# EAGLE schematic Telemetry_mainlayoutVer2 (EAGLE 8.2.1)
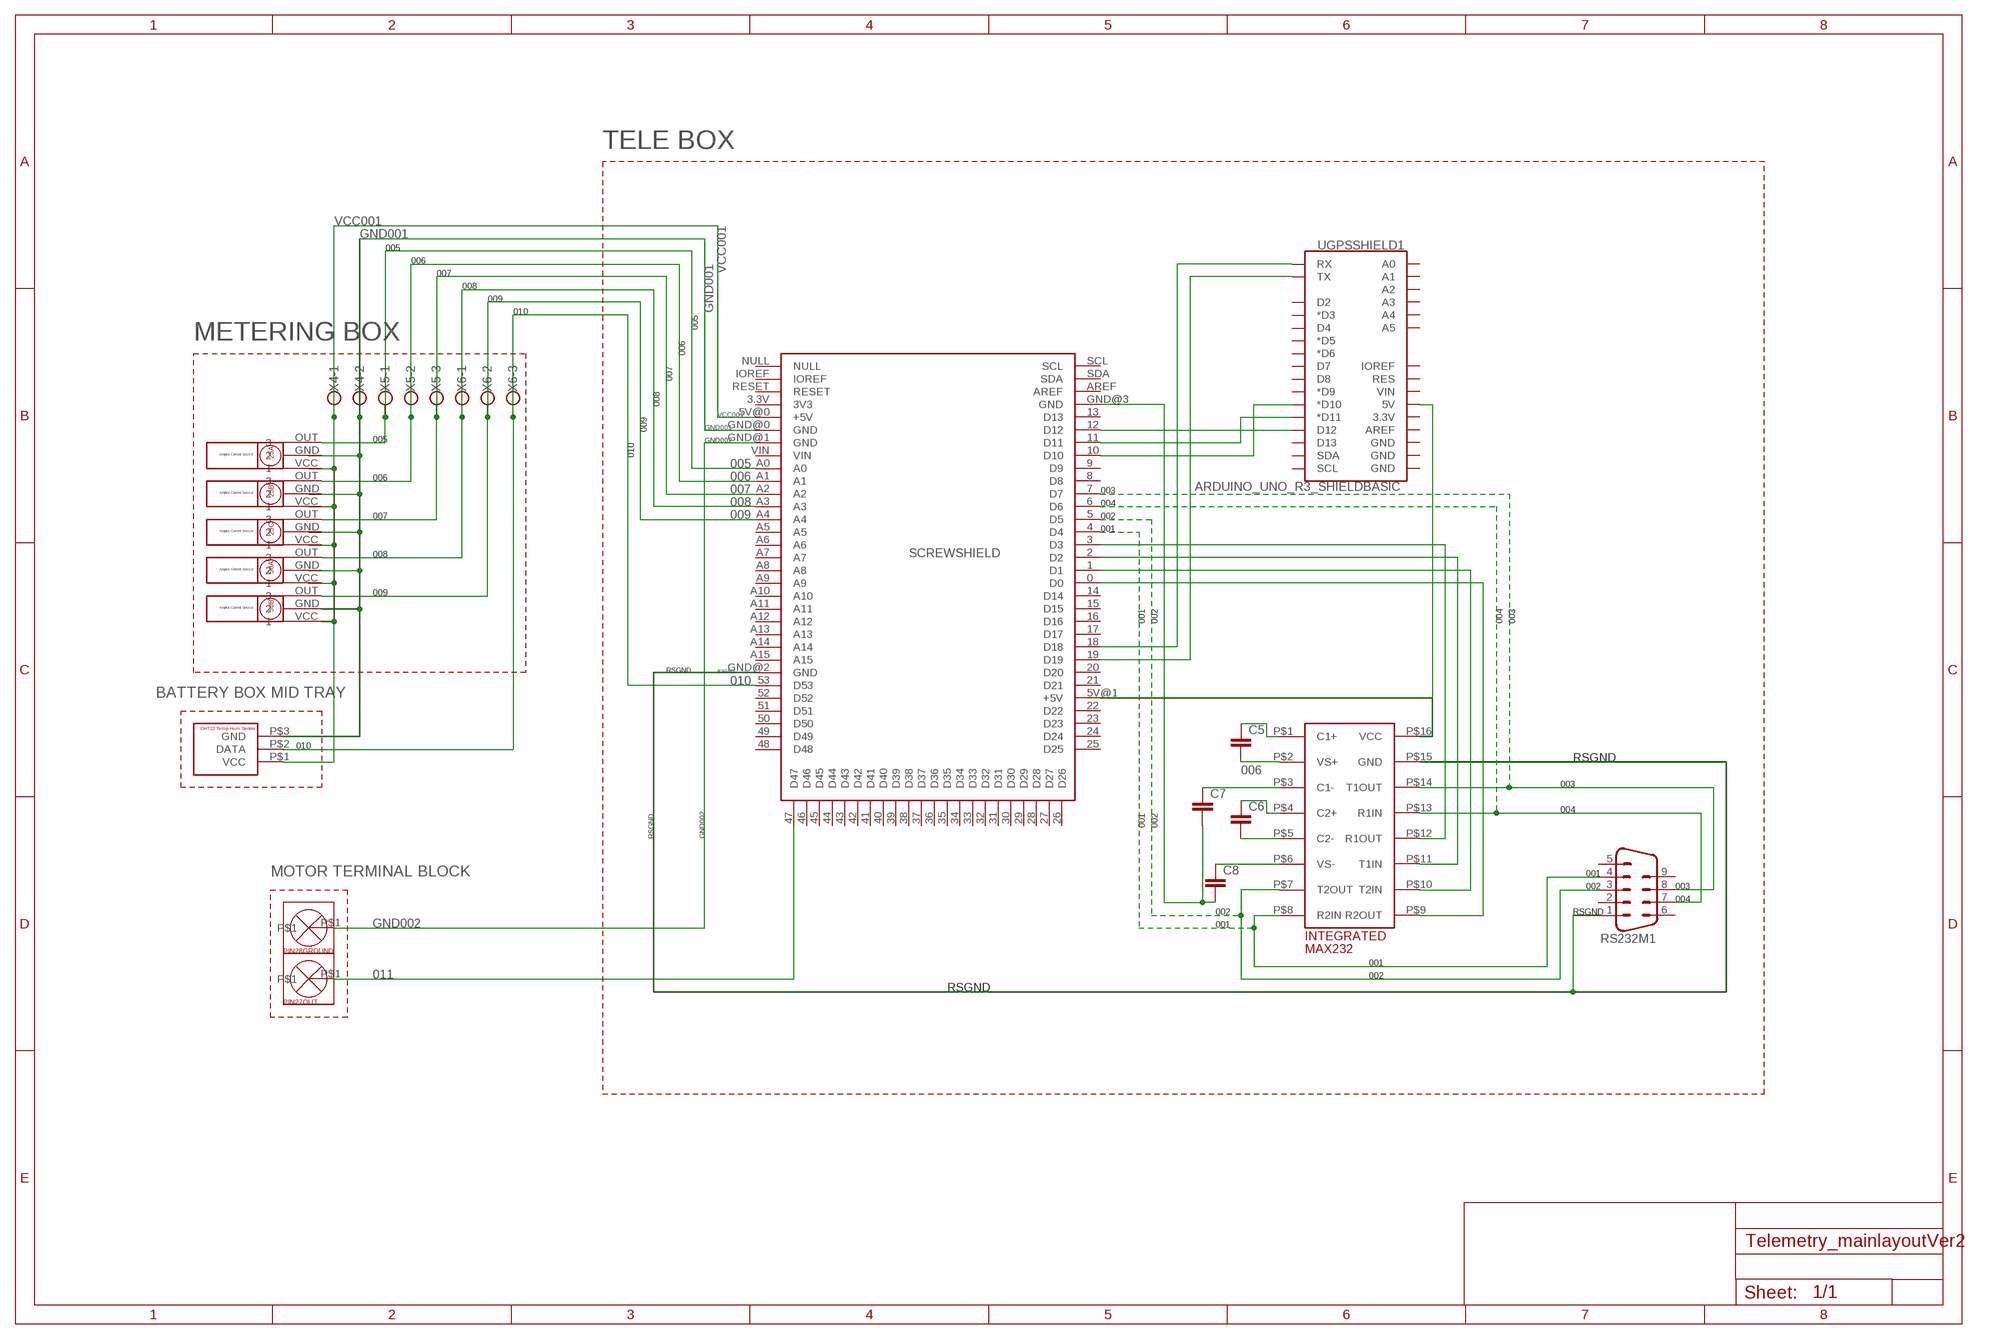
[diagram p0: schematic, sheet 1]

## Parts
25A  AMPLOC-CS  [AMPLOC]
25B  AMPLOC-CS  [AMPLOC]
25C  AMPLOC-CS  [AMPLOC]
50A  AMPLOC-CS  [AMPLOC]
50B  AMPLOC-CS  [AMPLOC]
C5  C2,5-3  [C2.5-3]
C6  C2,5-3  [C2.5-3]
C7  C2,5-3  [C2.5-3]
C8  C2,5-3  [C2.5-3]
INTEGRATED  MAX232TELE  [DIP16]
PIN27OUT  SCREWTERMINAL  [SCREWTERMINAL]
PIN28GROUND  SCREWTERMINAL  [SCREWTERMINAL]
RS232M1  M09HP  [M09HP]
SCREWSHIELD  PSCREWBPROTOSCREWSHIELD  [ARDUINO_MEGA]
U$8  DHT22  [DHT22]
UGPSSHIELD1  ARDUINO_UNO_R3_SHIELDBASIC  [UNO_R3_SHIELD]
X4  W237-102  [W237-102]
X5  W237-103  [W237-103]
X6  W237-103  [W237-103]

## Nets
N$1: INTEGRATED.P$8(R2IN) RS232M1.4 SCREWSHIELD.4(D4)
N$2: PIN28GROUND.P$1 SCREWSHIELD.GND@1(GND)
N$3: PIN27OUT.P$1 SCREWSHIELD.47(D47)
N$19: C5.1 INTEGRATED.P$1(C1+)
N$24: C5.2 INTEGRATED.P$2(VS+)
N$33: C6.2 INTEGRATED.P$5(C2-)
N$35: C6.1 INTEGRATED.P$4(C2+)
N$36: C8.1 INTEGRATED.P$6(VS-)
N$37: C7.2 C8.2 SCREWSHIELD.GND@3(GND)
N$38: INTEGRATED.P$16(VCC) SCREWSHIELD.5V@1(+5V) UGPSSHIELD1.5V
N$40: SCREWSHIELD.18(D18) UGPSSHIELD1.RX
N$41: SCREWSHIELD.19(D19) UGPSSHIELD1.TX
N$42: SCREWSHIELD.10(D10) UGPSSHIELD1.D10(*D10)
N$43: SCREWSHIELD.11(D11) UGPSSHIELD1.D11(*D11)
N$44: SCREWSHIELD.12(D12) UGPSSHIELD1.D12
N$45: 50B.OUT SCREWSHIELD.A4 X6.2
N$46: INTEGRATED.P$7(T2OUT) RS232M1.3 SCREWSHIELD.5(D5)
N$47: 25A.VCC 25B.VCC 25C.VCC 50A.VCC 50B.VCC SCREWSHIELD.5V@0(+5V) U$8.P$1(VCC) X4.1
N$48: INTEGRATED.P$15(GND) RS232M1.1 SCREWSHIELD.GND@2(GND)
N$49: INTEGRATED.P$13(R1IN) RS232M1.7 SCREWSHIELD.6(D6)
N$50: C7.1 INTEGRATED.P$3(C1-)
N$51: INTEGRATED.P$14(T1OUT) RS232M1.8 SCREWSHIELD.7(D7)
N$52: 50A.OUT SCREWSHIELD.A3 X6.1
N$53: 25A.OUT SCREWSHIELD.A0 X5.1
N$54: 25C.OUT SCREWSHIELD.A2 X5.3
N$55: 25B.OUT SCREWSHIELD.A1 X5.2
N$58: SCREWSHIELD.53(D53) U$8.P$2(DATA) X6.3
N$59: INTEGRATED.P$12(R1OUT) SCREWSHIELD.3(D3)
N$60: INTEGRATED.P$11(T1IN) SCREWSHIELD.2(D2)
N$61: INTEGRATED.P$10(T2IN) SCREWSHIELD.1(D1)
N$62: INTEGRATED.P$9(R2OUT) SCREWSHIELD.0(D0)
N$63: 25A.GND 25B.GND 25C.GND 50A.GND 50B.GND SCREWSHIELD.GND@0(GND) U$8.P$3(GND) X4.2
Unconnected: RS232M1.2 RS232M1.5 RS232M1.6 RS232M1.9 SCREWSHIELD.3.3V(3V3) SCREWSHIELD.8(D8) SCREWSHIELD.9(D9) SCREWSHIELD.13(D13) SCREWSHIELD.14(D14) SCREWSHIELD.15(D15) SCREWSHIELD.16(D16) SCREWSHIELD.17(D17) SCREWSHIELD.20(D20) SCREWSHIELD.21(D21) SCREWSHIELD.22(D22) SCREWSHIELD.23(D23) SCREWSHIELD.24(D24) SCREWSHIELD.25(D25) SCREWSHIELD.26(D26) SCREWSHIELD.27(D27) SCREWSHIELD.28(D28) SCREWSHIELD.29(D29) SCREWSHIELD.30(D30) SCREWSHIELD.31(D31) SCREWSHIELD.32(D32) SCREWSHIELD.33(D33) SCREWSHIELD.34(D34) SCREWSHIELD.35(D35) SCREWSHIELD.36(D36) SCREWSHIELD.37(D37) SCREWSHIELD.38(D38) SCREWSHIELD.39(D39) SCREWSHIELD.40(D40) SCREWSHIELD.41(D41) SCREWSHIELD.42(D42) SCREWSHIELD.43(D43) SCREWSHIELD.44(D44) SCREWSHIELD.45(D45) SCREWSHIELD.46(D46) SCREWSHIELD.48(D48) SCREWSHIELD.49(D49) SCREWSHIELD.50(D50) SCREWSHIELD.51(D51) SCREWSHIELD.52(D52) SCREWSHIELD.A5 SCREWSHIELD.A6 SCREWSHIELD.A7 SCREWSHIELD.A8 SCREWSHIELD.A9 SCREWSHIELD.A10 SCREWSHIELD.A11 SCREWSHIELD.A12 SCREWSHIELD.A13 SCREWSHIELD.A14 SCREWSHIELD.A15 SCREWSHIELD.AREF SCREWSHIELD.IOREF SCREWSHIELD.NULL SCREWSHIELD.RESET SCREWSHIELD.SCL SCREWSHIELD.SDA SCREWSHIELD.VIN UGPSSHIELD1.3.3V UGPSSHIELD1.A0 UGPSSHIELD1.A1 UGPSSHIELD1.A2 UGPSSHIELD1.A3 UGPSSHIELD1.A4 UGPSSHIELD1.A5 UGPSSHIELD1.AREF UGPSSHIELD1.D2 UGPSSHIELD1.D3(*D3) UGPSSHIELD1.D4 UGPSSHIELD1.D5(*D5) UGPSSHIELD1.D6(*D6) UGPSSHIELD1.D7 UGPSSHIELD1.D8 UGPSSHIELD1.D9(*D9) UGPSSHIELD1.D13 UGPSSHIELD1.GND@0(GND) UGPSSHIELD1.GND@1(GND) UGPSSHIELD1.GND@2(GND) UGPSSHIELD1.IOREF UGPSSHIELD1.RES UGPSSHIELD1.SCL UGPSSHIELD1.SDA UGPSSHIELD1.VIN

## Notes on the sheet
- TELE BOX
- VCC001 | VCC001
- GND001
- 005
- 006 | GND001
- 007
- 008
- 009
- 010 | 005
- METERING BOX | 006
- 007
- 008
- 009 | VCC001
- GND001
- 005 | 010 | GND002
- 005
- 006 | 006
- 007 | 003
- 008 | 004
- 007 | 009 | 002
- 001
- 008
- 009
- 001 | 002 | 004 | 003
- RSGND | RSGND
- 010
- BATTERY BOX MID TRAY
- 010
- RSGND
- 006
- 003
- 001 | 002 | 004
- RSGND | GND002
- MOTOR TERMINAL BLOCK | 001
- 002 | 003
- 004
- 002 | RSGND
- GND002 | 001
- 001
- 011 | 002
- RSGND

## Library data of the parts
25A 25B 25C 50A 50B = TelemetryCustom:AMPLOC-CS
C5-C8 = capacitor-wima:C: CAPACITOR naming: grid - package width
INTEGRATED = MAX232TELE:MAX232TELE
PIN27OUT PIN28GROUND = TelemetryCustom:SCREWTERMINAL
RS232M1 = con-subd:M09: SUB-D; OC_FARNELL: unknown; OC_NEWARK: unknown
SCREWSHIELD = TelemetryCustom:PSCREWB
U$8 = TelemetryCustom:DHT22
UGPSSHIELD1 = SparkFun-Boards:ARDUINO_UNO_R3_SHIELD: Arduino R3 Shield Footprint Shield form compatible with the Arduino Uno R3. SparkFun Products: MG2639 Cellular Shield <https://www.sparkfun.com/products/13120> MIDI Shield <https://www.sparkfun.com/products/12898> R3 Stackable Headers Kit <https://www.sparkfun.com/products/11417>
X4 = con-wago-500:W237-102: WAGO SCREW CLAMP; MPN: 237-102; OC_FARNELL: unknown; OC_NEWARK: 70K9898
X5 X6 = con-wago-500:W237-103: WAGO SCREW CLAMP; MPN: 237-103; OC_FARNELL: unknown; OC_NEWARK: 18M7116